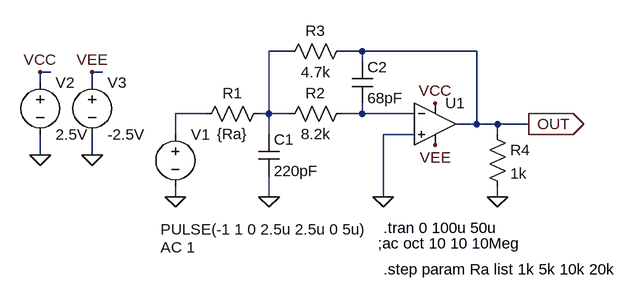
[diagram p0: schematic 2nd Multipule FeedBack.asc]
2nd Multipule FeedBack.asc, the LTspice schematic file:
Version 4
SHEET 1 880 680
WIRE -160 48 -192 48
WIRE -48 48 -80 48
WIRE 128 48 -48 48
WIRE -48 64 -48 48
WIRE -528 80 -544 80
WIRE -448 80 -464 80
WIRE -544 96 -544 80
WIRE -464 96 -464 80
WIRE -288 144 -336 144
WIRE -192 144 -192 48
WIRE -192 144 -208 144
WIRE -160 144 -192 144
WIRE -48 144 -48 128
WIRE -48 144 -80 144
WIRE 32 144 -48 144
WIRE 128 160 128 48
WIRE 128 160 96 160
WIRE 160 160 128 160
WIRE 208 160 160 160
WIRE -336 176 -336 144
WIRE -192 176 -192 144
WIRE 32 176 -16 176
WIRE 160 176 160 160
WIRE -544 208 -544 176
WIRE -464 208 -464 176
WIRE -336 272 -336 256
WIRE -192 272 -192 240
WIRE -16 272 -16 176
WIRE 160 272 160 256
FLAG -336 272 0
FLAG -192 272 0
FLAG -16 272 0
FLAG -544 208 0
FLAG -464 208 0
FLAG -544 80 VCC
FLAG -464 80 VEE
FLAG 64 128 VCC
FLAG 64 192 VEE
FLAG 160 272 0
FLAG 208 160 OUT
IOPIN 208 160 Out
SYMBOL res -192 128 R90
WINDOW 0 0 56 VBottom 2
WINDOW 3 32 56 VTop 2
SYMATTR InstName R1
SYMATTR Value {Ra}
SYMBOL res -64 128 R90
WINDOW 0 0 56 VBottom 2
WINDOW 3 32 56 VTop 2
SYMATTR InstName R2
SYMATTR Value 8.2k
SYMBOL res -64 32 R90
WINDOW 0 0 56 VBottom 2
WINDOW 3 32 56 VTop 2
SYMATTR InstName R3
SYMATTR Value 4.7k
SYMBOL cap -208 176 R0
SYMATTR InstName C1
SYMATTR Value 220pF
SYMBOL cap -64 64 R0
SYMATTR InstName C2
SYMATTR Value 68pF
SYMBOL voltage -336 160 R0
WINDOW 3 -23 162 Left 2
WINDOW 123 -23 190 Left 2
WINDOW 39 0 0 Left 2
SYMATTR Value PULSE(-1 1 0 2.5u 2.5u 0 5u)
SYMATTR Value2 AC 1
SYMATTR InstName V1
SYMBOL voltage -544 80 R0
WINDOW 123 0 0 Left 2
WINDOW 39 0 0 Left 2
SYMATTR InstName V2
SYMATTR Value 2.5V
SYMBOL voltage -464 80 R0
WINDOW 123 0 0 Left 2
WINDOW 39 0 0 Left 2
SYMATTR InstName V3
SYMATTR Value -2.5V
SYMBOL Opamps\\UniversalOpamp2 64 160 R0
SYMATTR InstName U1
SYMBOL res 144 160 R0
SYMATTR InstName R4
SYMATTR Value 1k
TEXT -16 320 Left 2 !.tran 0 100u 50u
TEXT -24 344 Left 2 !;ac oct 10 10 10Meg
TEXT -16 384 Left 2 !.step param Ra list 1k 5k 10k 20k

The netlist it stands for:
* 2nd Multipule FeedBack.asc
R1 N001 N002 {Ra}
R2 N003 N001 8.2k
R3 OUT N001 4.7k
C1 N001 0 220pF
C2 OUT N003 68pF
V1 N002 0 PULSE(-1 1 0 2.5u 2.5u 0 5u) AC 1
V2 VCC 0 2.5V
V3 VEE 0 -2.5V
XU1 0 N003 VCC VEE OUT level.2 Avol=1Meg GBW=10Meg Slew=10Meg ilimit=25m rail=0 Vos=0 phimargin=45 en=0 enk=0 in=0 ink=0 Rin=500Meg  ; pins IN+ IN- V+ V- OUT
R4 OUT 0 1k
.tran 0 100u 50u
;ac oct 10 10 10Meg
.step param Ra list 1k 5k 10k 20k
.lib UniversalOpamps2.sub
.backanno
.end